# EAGLE schematic USB_Amp (EAGLE 9.6.2)
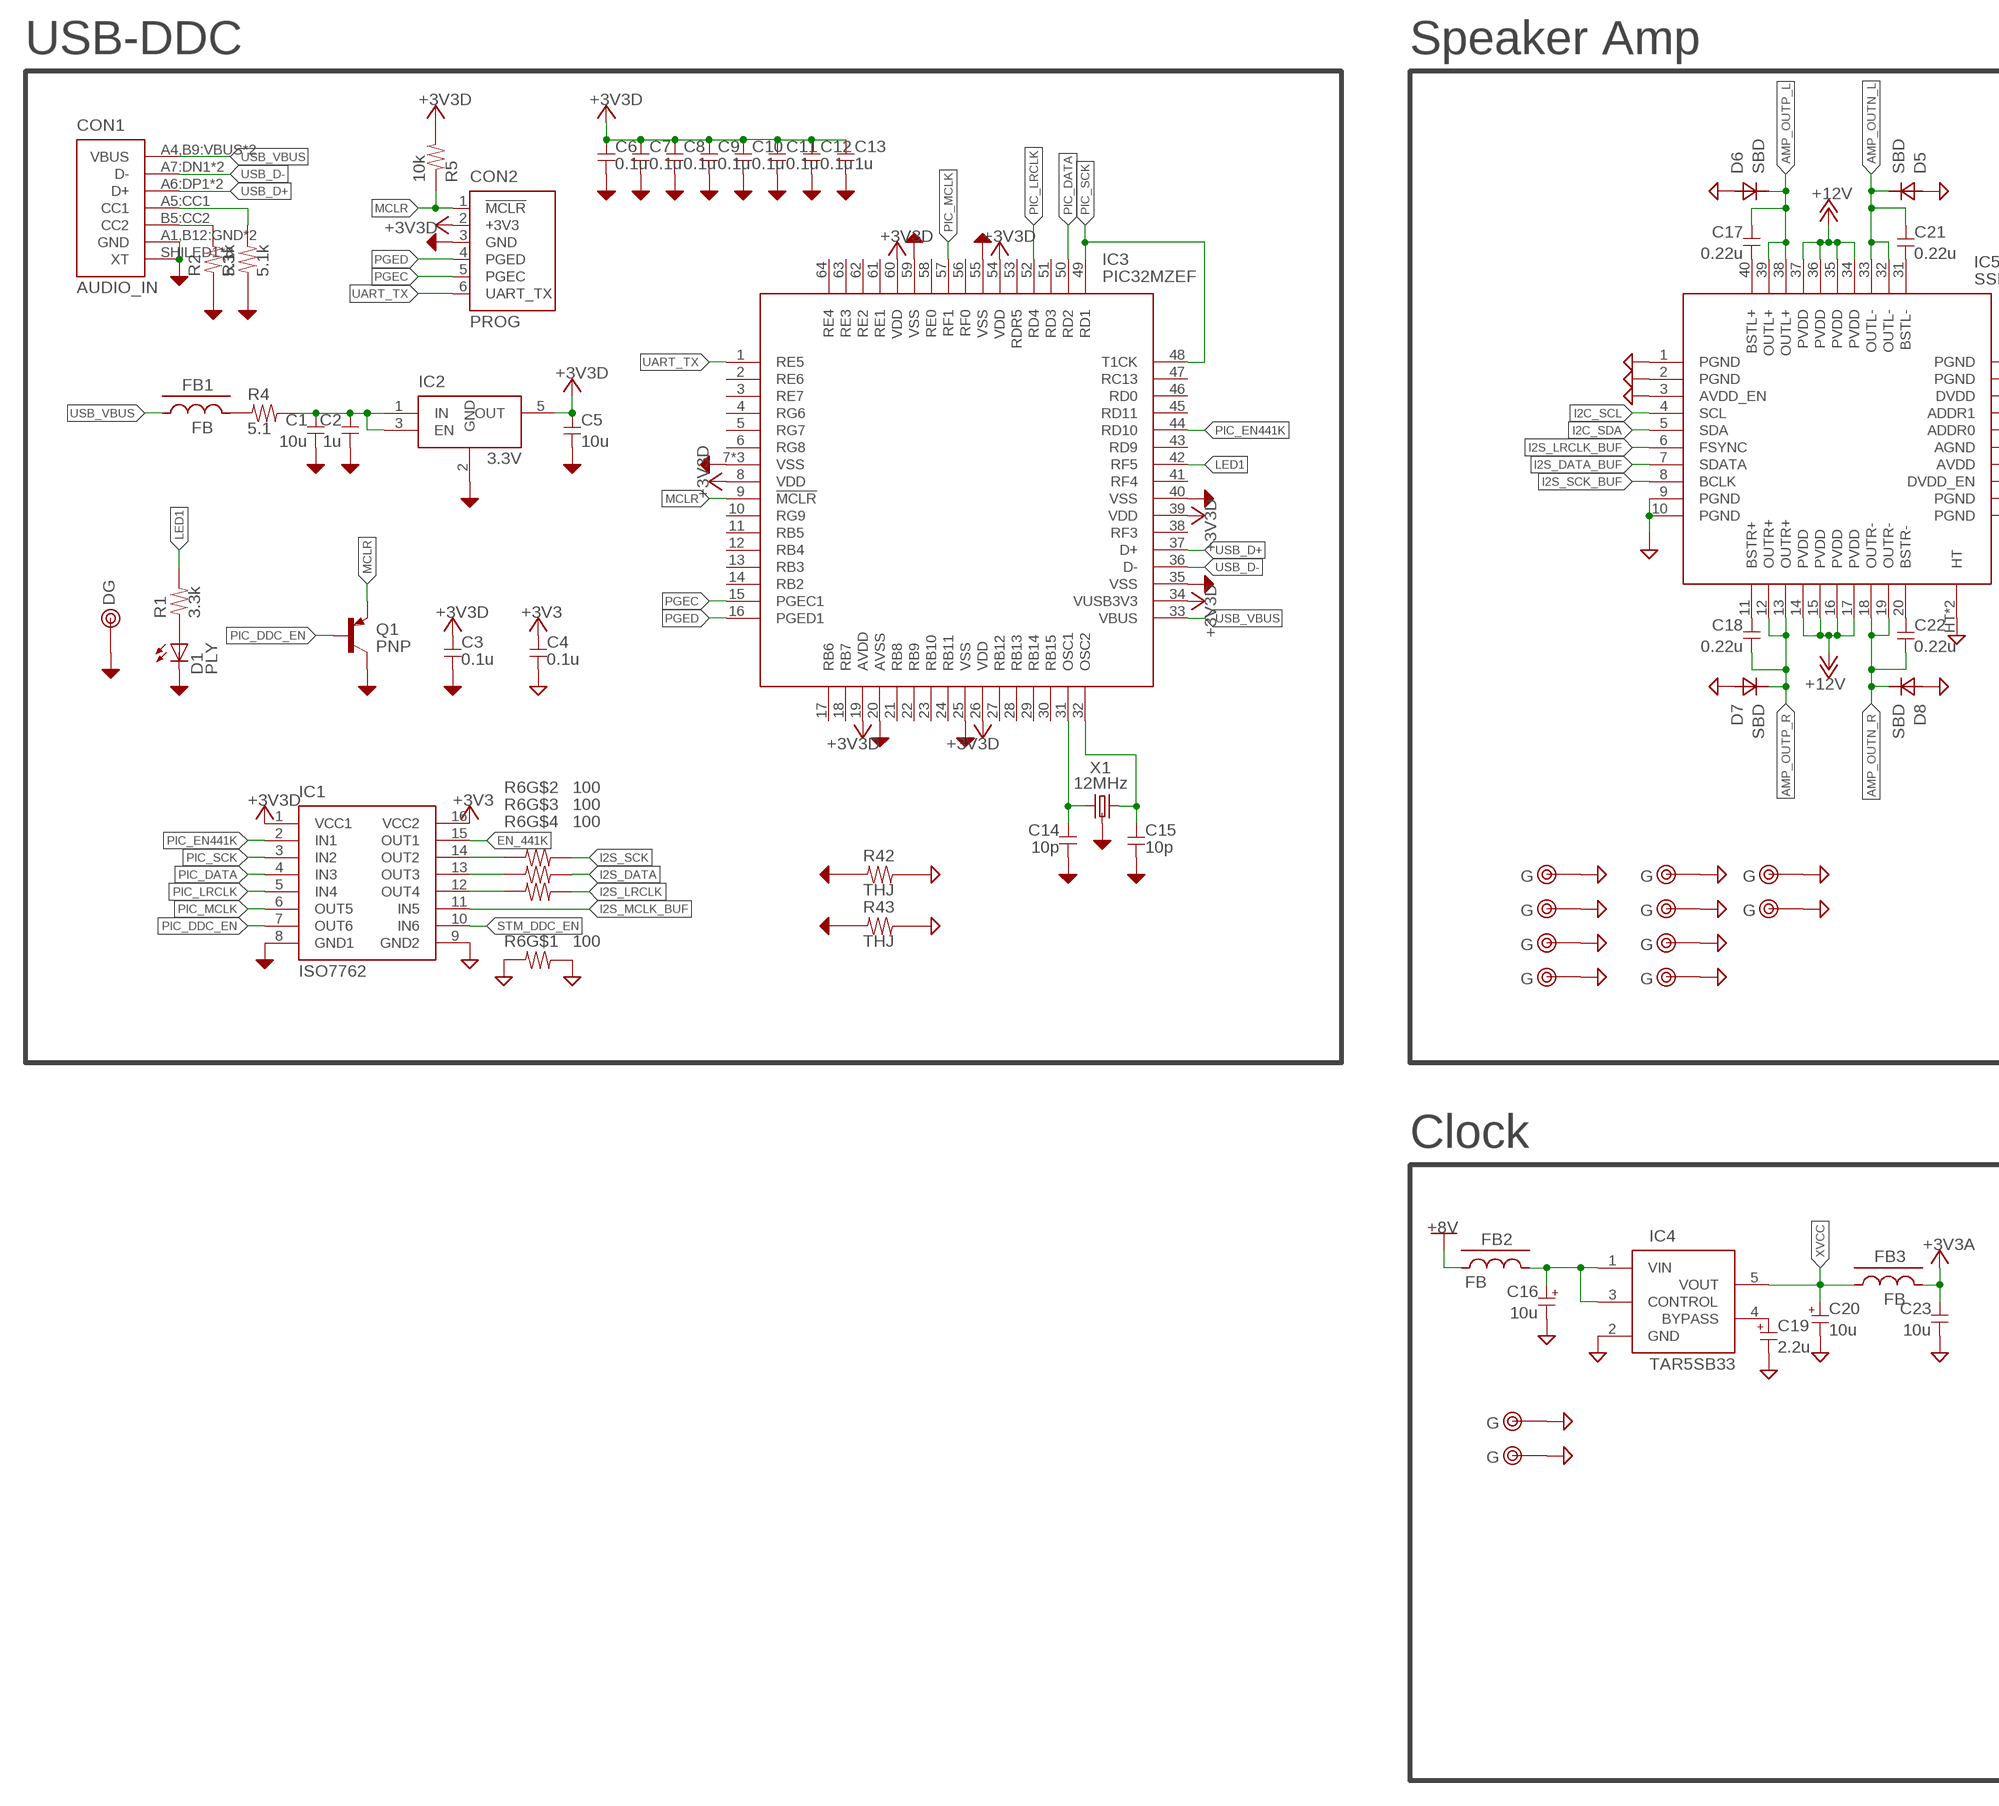
[diagram p0: schematic, sheet 1, part 1 of 2]
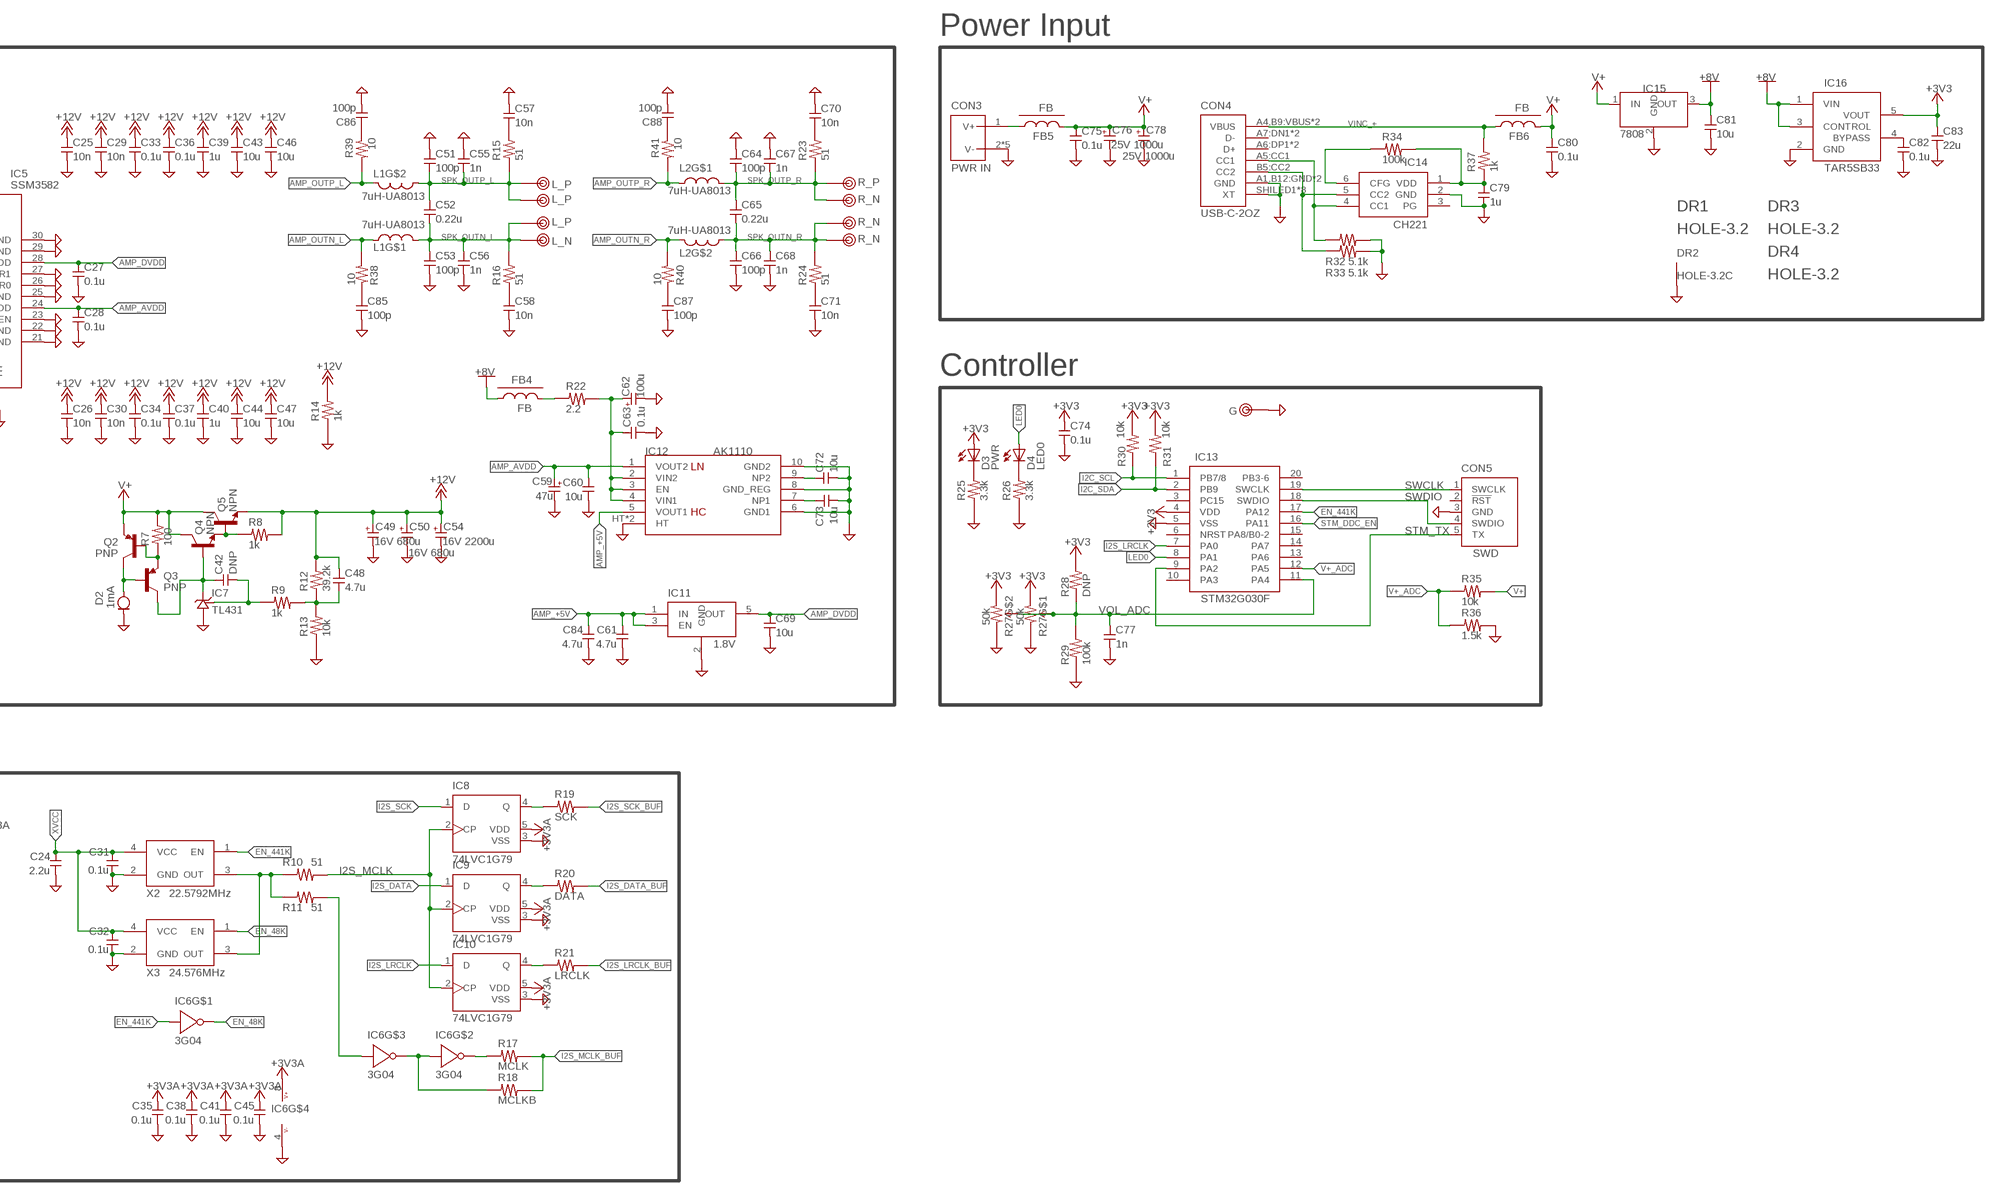
[diagram p1: schematic, sheet 1, part 2 of 2]

## Parts
C1  10u  C-2012  [2012]
C2  1u  C-1608  [1608C]
C3  0.1u  C-1608  [1608C]
C4  0.1u  C-1005  [1005]
C5  10u  C-2012  [2012]
C6  0.1u  C-1608  [1608C]
C7  0.1u  C-1608  [1608C]
C8  0.1u  C-1608  [1608C]
C9  0.1u  C-1608  [1608C]
C10  0.1u  C-1608  [1608C]
C11  0.1u  C-1608  [1608C]
C12  0.1u  C-1608  [1608C]
C13  1u  C-1608  [1608C]
C14  10p  C-1005  [1005]
C15  10p  C-1005  [1005]
C16  10u  CPOL2012  [2012-POL]
C17  0.22u  C-1608  [1608C]
C18  0.22u  C-1608  [1608C]
C19  2.2u  CPOL2012  [2012-POL]
C20  10u  CPOL2012  [2012-POL]
C21  0.22u  C-1608  [1608C]
C22  0.22u  C-1608  [1608C]
C23  10u  C-2012  [2012]
C24  2.2u  C-2012  [2012]
C25  10n  C-1005  [1005]
C26  10n  C-1005  [1005]
C27  0.1u  C-1608  [1608C]
C28  0.1u  C-1608  [1608C]
C29  10n  C-1005  [1005]
C30  10n  C-1005  [1005]
C31  0.1u  C-1608  [1608C]
C32  0.1u  C-1608  [1608C]
C33  0.1u  C-1005  [1005]
C34  0.1u  C-1005  [1005]
C35  0.1u  C-1005  [1005]
C36  0.1u  C-1005  [1005]
C37  0.1u  C-1005  [1005]
C38  0.1u  C-1005  [1005]
C39  1u  C-2012  [2012]
C40  1u  C-2012  [2012]
C41  0.1u  C-1005  [1005]
C42  DNP  C-1608  [1608C]
C43  10u  C-3225  [3225]
C44  10u  C-3225  [3225]
C45  0.1u  C-1005  [1005]
C46  10u  C-3225  [3225]
C47  10u  C-3225  [3225]
C48  4.7u  C-3216  [3216]
C49  16V 680u  CPOLE5-10  [E5-10]
C50  16V 680u  CPOLE5-10  [E5-10]
C51  100p  C-1608  [1608C]
C52  0.22u  C-5W  [C050W]
C53  100p  C-1608  [1608C]
C54  16V 2200u  CPOLE5-13  [E5-13]
C55  1n  C-2012  [2012]
C56  1n  C-2012  [2012]
C57  10n  C-5W2  [C050W2]
C58  10n  C-5W2  [C050W2]
C59  47u  CPOLE2.5-5  [E2.5-5]
C60  10u  C-2012  [2012]
C61  4.7u  C-2012  [2012]
C62  100u  CPOLE2.5-6.5  [E2.5-6.5]
C63  0.1u  C-1608  [1608C]
C64  100p  C-1608  [1608C]
C65  0.22u  C-5W  [C050W]
C66  100p  C-1608  [1608C]
C67  1n  C-2012  [2012]
C68  1n  C-2012  [2012]
C69  10u  C-2012  [2012]
C70  10n  C-5W2  [C050W2]
C71  10n  C-5W2  [C050W2]
C72  10u  C-2012  [2012]
C73  10u  C-2012  [2012]
C74  0.1u  C-1608  [1608C]
C75  0.1u  C-1608  [1608C]
C76  25V 1000u  CPOLE5-10  [E5-10]
C77  1n  C-1608  [1608C]
C78  25V 1000u  CPOLE5-10  [E5-10]
C79  1u  C-1608  [1608C]
C80  0.1u  C-1608  [1608C]
C81  10u  C-3216  [3216]
C82  0.1u  C-1608  [1608C]
C83  22u  C-2012  [2012]
C84  4.7u  C-2012  [2012]
C85  100p  C-1608  [1608C]
C86  100p  C-1608  [1608C]
C87  100p  C-1608  [1608C]
C88  100p  C-1608  [1608C]
CON1  AUDIO_IN  USB-C-2OZ  [5077CR-16-SMC2-BK-TR-2OZ]
CON2  PROG  PIC32_CON  [1X06]
CON3  PWR IN  POWER_CON  [2.1MM_CON]
CON4  USB-C-2OZ  [5077CR-16-SMC2-BK-TR-2OZ]
CON5  SWD  SWD_CON  [SWD_CON]
D1  PLY  LED-SMD1608  [D1608]
D2  1mA  CRD-SMD  [SOD123]
D3  PWR  LED-2.5  [LED2.5]
D4  LED0  LED-2.5  [LED2.5]
D5  SBD  DIODE-323  [SOD323]
D6  SBD  DIODE-323  [SOD323]
D7  SBD  DIODE-323  [SOD323]
D8  SBD  DIODE-323  [SOD323]
DR1  HOLE-3.2  [HOLE_3.2]
DR2  HOLE-3.2C  [HOLE_3.2_CON2]
DR3  HOLE-3.2  [HOLE_3.2]
DR4  HOLE-3.2  [HOLE_3.2]
FB1  FB  FB-1608FB  [1608-FB]
FB2  FB  FB-1608FB  [1608-FB]
FB3  FB  FB-1608FB  [1608-FB]
FB4  FB  FB-2012-FB  [2012-R]
FB5  FB  FB-3216  [3216-FB]
FB6  FB  FB-3216  [3216-FB]
IC1  ISO7762  ISO6762-SSOP  [TSSOP16]
IC2  3.3V  TLV740  [SOT23-5]
IC3  PIC32MZEF  [QFN64HT]
IC4  TAR5SB33  [SOT23-5]
IC5  SSM3582  [QFN40HT]
IC6  3G04  TC7WU04FU  [SSOP8-P-0.65]
IC7  TL431  TL431-SC59  [SC59]
IC8  74LVC1G79  [TSSOP5]
IC9  74LVC1G79  [TSSOP5]
IC10  74LVC1G79  [TSSOP5]
IC11  1.8V  TLV740  [SOT23-5]
IC12  AK1110  [PLP10]
IC13  STM32G030F  [TSSOP20]
IC14  CH221  [SOT23-6]
IC15  7808  78X-SOP  [DPAK]
IC16  TAR5SB33  [SOT23-5]
L1  7uH-UA8013  L-DUAL  [UA8014]
L2  7uH-UA8013  L-DUAL  [UA8014]
Q1  PNP  PNP2SA1313  [SC59]
Q2  PNP  PNP2SA1313  [SC59]
Q3  PNP  PNP2SA1313  [SC59]
Q4  NPN  NPN2SC3325  [SC59]
Q5  NPN  NPN-SOT223  [SOT223]
R1  3.3k  R-1608  [1608]
R2  5.1k  R-1608  [1608]
R3  5.1k  R-1608  [1608]
R4  5.1  R-1608  [1608]
R5  10k  R-1608  [1608]
R6  100  R-ARRAY  [EXB28V]
R7  100  R-1608  [1608]
R8  1k  R-1608  [1608]
R9  1k  R-1608  [1608]
R10  51  R-1005  [1005]
R11  51  R-1005  [1005]
R12  39.2k  R-1608  [1608]
R13  10k  R-1608  [1608]
R14  1k  R-3216  [3216]
R15  51  R-2012  [2012]
R16  51  R-2012  [2012]
R17  MCLK  R-1005  [1005]
R18  MCLKB  R-1005  [1005]
R19  SCK  R-1005  [1005]
R20  DATA  R-1005  [1005]
R21  LRCLK  R-1005  [1005]
R22  2.2  R-2012H  [2012-R]
R23  51  R-2012  [2012]
R24  51  R-2012  [2012]
R25  3.3k  R-1608  [1608]
R26  3.3k  R-1608  [1608]
R27  50k  R-VAL2  [RK0972]
R28  DNP  R-1608  [1608]
R29  100k  R-1608  [1608]
R30  10k  R-1608  [1608]
R31  10k  R-1608  [1608]
R32  5.1k  R-1608  [1608]
R33  5.1k  R-1608  [1608]
R34  100k  R-1608  [1608]
R35  10k  R-1608  [1608]
R36  1.5k  R-1608  [1608]
R37  1k  R-2012  [2012]
R38  10  R-1608  [1608]
R39  10  R-1608  [1608]
R40  10  R-1608  [1608]
R41  10  R-1608  [1608]
R42  THJ  R-3216-2  [3216-2]
R43  THJ  R-3216-2  [3216-2]
TP1  L_P  TESTPIN-BIG  [TESTPIN-BIG]
TP2  L_N  TESTPIN-BIG  [TESTPIN-BIG]
TP3  R_P  TESTPIN-BIG  [TESTPIN-BIG]
TP4  R_N  TESTPIN-BIG  [TESTPIN-BIG]
TP5  DG  TESTPIN  [TESTPIN]
TP6  G  TESTPIN  [TESTPIN]
TP7  G  TESTPIN  [TESTPIN]
TP8  G  TESTPIN  [TESTPIN]
TP9  G  TESTPIN  [TESTPIN]
TP10  G  TESTPIN  [TESTPIN]
TP11  G  TESTPIN  [TESTPIN]
TP12  G  TESTPIN  [TESTPIN]
TP13  G  TESTPIN  [TESTPIN]
TP14  G  TESTPIN  [TESTPIN]
TP15  G  TESTPIN  [TESTPIN]
TP16  G  TESTPIN  [TESTPIN]
TP17  G  TESTPIN  [TESTPIN]
TP18  G  TESTPIN  [TESTPIN]
TP19  L_P  TESTPIN-MID  [TESTPIN-MID]
TP20  L_P  TESTPIN-MID  [TESTPIN-MID]
TP21  R_N  TESTPIN-MID  [TESTPIN-MID]
TP22  R_N  TESTPIN-MID  [TESTPIN-MID]
X1  12MHz  CRYSTAL2  [KC3225-CRYSTAL]
X2  22.5792MHz  OSC-KC3225  [KC3225]
X3  24.576MHz  OSC-KC3225  [KC3225]

## Nets
+3V3: C4.1 C74.1 C83.1 D3.A IC1.16(VCC2) IC13.4(VDD) IC16.5(VOUT) R27.3 R27.6 R28.2 R30.2 R31.2
+3V3A: C23.1 C35.1 C38.1 C41.1 C45.1 FB3.2 IC6.8(V+) IC8.5(VDD) IC9.5(VDD) IC10.5(VDD)
+3V3D: C3.1 C5.1 C6.1 C7.1 C8.1 C9.1 C10.1 C11.1 C12.1 C13.1 CON2.2(+3V3) IC1.1(VCC1) IC2.5(OUT) IC3.8(VDD) IC3.19(AVDD) IC3.26(VDD) IC3.34(VUSB3V3) IC3.39(VDD) IC3.54(VDD) IC3.60(VDD) R5.2
+8V: C81.1 FB2.1 FB4.1 IC15.3(OUT) IC16.1(VIN) IC16.3(CONTROL)
+12V: C25.1 C26.1 C29.1 C30.1 C33.1 C34.1 C36.1 C37.1 C39.1 C40.1 C43.1 C44.1 C46.1 C47.1 C48.1 C49.+ C50.+ C54.+ IC5.14(PVDD) IC5.15(PVDD) IC5.16(PVDD) IC5.17(PVDD) IC5.34(PVDD) IC5.35(PVDD) IC5.36(PVDD) IC5.37(PVDD) Q5.3(E) R8.2 R12.2 R14.2
AMP_+5V: C61.1 C84.1 IC11.1(IN) IC11.3(EN) IC12.5(VOUT1)
AMP_AVDD: C28.1 C59.+ C60.1 IC5.24(AVDD) IC12.1(VOUT2)
AMP_DVDD: C27.1 C69.1 IC5.28(DVDD) IC11.5(OUT)
AMP_OUTN_L: C21.1 D5.2(K) IC5.32(OUTL-) IC5.33(OUTL-) L1.1 R38.2
AMP_OUTN_R: C22.2 D8.2(K) IC5.18(OUTR-) IC5.19(OUTR-) L2.4 R40.2
AMP_OUTP_L: C17.1 D6.2(K) IC5.38(OUTL+) IC5.39(OUTL+) L1.4 R39.2
AMP_OUTP_R: C18.2 D7.2(K) IC5.12(OUTR+) IC5.13(OUTR+) L2.1 R41.2
DGND: C1.2 C2.2 C3.2 C5.2 C6.2 C7.2 C8.2 C9.2 C10.2 C11.2 C12.2 C13.2 C14.2 C15.2 CON1.A1,B12:GND(GND) CON1.B1,A12:GND(GND) CON1.SHILED1(XT) CON1.SHILED2(XT) CON1.SHILED3(XT) CON1.SHILED4(XT) CON1.SHILED5(XT) CON1.SHILED6(XT) CON1.SHILED7(XT) CON1.SHILED8(XT) CON2.3(GND) D1.K IC1.8(GND1) IC2.2(GND) IC3.7(VSS) IC3.20(AVSS) IC3.25(VSS) IC3.35(VSS) IC3.40(VSS) IC3.55(VSS) IC3.59(VSS) IC3.HT2(VSS) IC3.HT(VSS) Q1.3(C) R2.1 R3.1 R42.1 R43.1 TP5.1 X1.2(GND) X1.4(GND)
EN_48K: IC6.7(OUT) X3.1(EN)
EN_441K: IC1.15(OUT1) IC6.1(IN) IC13.17(PA12) X2.1(EN)
GND: C4.2 C16.2 C19.2 C20.2 C23.2 C24.2 C25.2 C26.2 C27.2 C28.2 C29.2 C30.2 C31.2 C32.2 C33.2 C34.2 C35.2 C36.2 C37.2 C38.2 C39.2 C40.2 C41.2 C43.2 C44.2 C45.2 C46.2 C47.2 C49.- C50.- C51.1 C53.2 C54.- C55.1 C56.2 C57.1 C57.3 C58.2 C58.4 C59.- C60.2 C61.2 C62.- C63.2 C64.1 C66.2 C67.1 C68.2 C69.2 C70.1 C70.3 C71.2 C71.4 C72.2 C73.2 C74.2 C75.2 C76.- C77.2 C78.- C79.2 C80.2 C81.2 C82.2 C83.2 C84.2 C85.2 C86.2 C87.2 C88.2 CON3.2(V-) CON3.3(V-) CON3.4(V-) CON3.5(V-) CON3.6(V-) CON4.A1,B12:GND(GND) CON4.B1,A12:GND(GND) CON4.SHILED1(XT) CON4.SHILED2(XT) CON4.SHILED3(XT) CON4.SHILED4(XT) CON4.SHILED5(XT) CON4.SHILED6(XT) CON4.SHILED7(XT) CON4.SHILED8(XT) CON5.3(GND) D2.2(K) D5.1(A) D6.1(A) D7.1(A) D8.1(A) DR2.T(HT) IC1.9(GND2) IC4.2(GND) IC5.1(PGND) IC5.2(PGND) IC5.3(AVDD_EN) IC5.9(PGND) IC5.10(PGND) IC5.21(PGND) IC5.22(PGND) IC5.23(DVDD_EN) IC5.25(AGND) IC5.26(ADDR0) IC5.27(ADDR1) IC5.29(PGND) IC5.30(PGND) IC5.HT IC5.HT2(HT) IC6.4(V-) IC7.3(GND) IC8.3(VSS) IC9.3(VSS) IC10.3(VSS) IC11.2(GND) IC12.6(GND1) IC12.8(GND_REG) IC12.10(GND2) IC12.HT IC12.HT2(HT) IC13.5(VSS) IC14.2(GND) IC15.2(GND) IC16.2(GND) R6.1 R6.8 R13.1 R14.1 R25.1 R26.1 R27.1 R27.4 R29.1 R32.2 R33.2 R36.2 R42.2 R43.2 TP6.1 TP7.1 TP8.1 TP9.1 TP10.1 TP11.1 TP12.1 TP13.1 TP14.1 TP15.1 TP16.1 TP17.1 TP18.1 X2.2(GND) X3.2(GND)
I2C_SCL: IC5.4(SCL) IC13.1(PB7/8) R30.1
I2C_SDA: IC5.5(SDA) IC13.2(PB9) R31.1
I2S_DATA: IC9.1(D) R6.6
I2S_DATA_BUF: IC5.7(SDATA) R20.2
I2S_LRCLK: IC10.1(D) IC13.7(PA0) R6.5
I2S_LRCLK_BUF: IC5.6(FSYNC) R21.2
I2S_MCLK: IC8.2(CP) IC9.2(CP) IC10.2(CP) R10.2
I2S_MCLK2: IC6.3(IN) R11.2
I2S_MCLK_BUF: IC1.11(IN5) R17.2 R18.2
I2S_SCK: IC8.1(D) R6.7
I2S_SCK_BUF: IC5.8(BCLK) R19.2
LED0: D4.A IC13.8(PA1)
LED1: IC3.42(RF5) R1.2
MCLK_OSC: R10.1 R11.1 X2.3(OUT) X3.3(OUT)
MCLR: CON2.1(!MCLR) IC3.9(!MCLR) Q1.2(E) R5.1
N$1: CON1.B5:CC2(CC2) R2.2
N$2: CON1.A5:CC1(CC1) R3.2
N$3: FB1.2 R4.1
N$4: C1.1 C2.1 IC2.1(IN) IC2.3(EN) R4.2
N$5: C14.1 IC3.31(OSC1) X1.3
N$6: C57.2 C57.4 R15.2
N$7: C15.1 IC3.32(OSC2) X1.1
N$8: IC1.14(OUT2) R6.2
N$9: D1.A R1.1
N$10: IC8.4(Q) R19.1
N$11: IC9.4(Q) R20.1
N$12: C21.2 IC5.31(BSTL-)
N$13: C17.2 IC5.40(BSTL+)
N$14: IC10.4(Q) R21.1
N$15: C58.1 C58.3 R16.1
N$16: Q4.2(E) Q5.1(B) R8.1
N$17: C18.1 IC5.11(BSTR+)
N$18: C22.1 IC5.20(BSTR-)
N$19: C71.1 C71.3 R24.1
N$20: C42.2 IC7.1(REF) R9.1
N$21: C70.2 C70.4 R23.2
N$22: IC1.13(OUT3) R6.3
N$23: C19.1 IC4.4(BYPASS)
N$24: IC1.12(OUT4) R6.4
N$25: C42.1 IC7.2(OUT) Q3.3(C) Q4.1(B)
N$26: C73.1 IC12.7(NP1)
N$27: C72.1 IC12.9(NP2)
N$28: Q2.1(B) Q3.2(E) R7.1
N$29: C62.+ C63.1 IC12.2(VIN2) IC12.3(EN) IC12.4(VIN1) R22.2
N$30: C48.2 R9.2 R12.1 R13.2
N$31: CON4.A5:CC1(CC1) IC14.4(CC1) R32.1
N$32: CON4.B5:CC2(CC2) IC14.5(CC2) R33.1
N$33: C79.1 IC14.1(VDD) R34.2 R37.1
N$34: IC14.6(CFG) R34.1
N$35: C82.1 IC16.4(BYPASS)
N$36: D3.K R25.2
N$37: IC6.5(OUT) IC6.6(IN) R18.1
N$38: D2.1(A) Q2.3(C) Q3.1(B)
N$39: IC6.2(OUT) R17.1
N$40: C86.1 R39.1
N$41: D4.K R26.2
N$42: FB4.2 R22.1
N$43: C16.1 FB2.2 IC4.1(VIN) IC4.3(CONTROL)
N$44: C87.1 R40.1
N$45: C85.1 R38.1
N$46: C88.1 R41.1
PGEC: CON2.5(PGEC) IC3.15(PGEC1)
PGED: CON2.4(PGED) IC3.16(PGED1)
PIC_DATA: IC1.4(IN3) IC3.50(RD2)
PIC_DDC_EN: IC1.7(OUT6) Q1.1(B)
PIC_EN441K: IC1.2(IN1) IC3.44(RD10)
PIC_LRCLK: IC1.5(IN4) IC3.52(RD4)
PIC_MCLK: IC1.6(OUT5) IC3.57(RF1)
PIC_SCK: IC1.3(IN2) IC3.48(T1CK) IC3.49(RD1)
SPK_OUTN_L: C52.2 C52.4 C53.1 C56.1 L1.2 R16.2 TP2.1 TP19.1
SPK_OUTN_R: C65.2 C65.4 C66.1 C68.1 L2.3 R24.2 TP4.1 TP22.1
SPK_OUTP_L: C51.2 C52.1 C52.3 C55.2 L1.3 R15.1 TP1.1 TP20.1
SPK_OUTP_R: C64.2 C65.1 C65.3 C67.2 L2.2 R23.1 TP3.1 TP21.1
STM_DDC_EN: IC1.10(IN6) IC13.16(PA11)
STM_TX: CON5.5(TX) IC13.9(PA2)
SWCLK: CON5.1(SWCLK) IC13.19(SWCLK)
SWDIO: CON5.4(SWDIO) IC13.18(SWDIO)
UART_TX: CON2.6(UART_TX) IC3.1(RE5)
USB_D+ [USB]: CON1.A6:DP1(D+) CON1.B6:DP2(D+) IC3.37(D+)
USB_D- [USB]: CON1.A7:DN1(D-) CON1.B7:DN2(D-) IC3.36(D-)
USB_VBUS: CON1.A4,B9:VBUS(VBUS) CON1.B4,A9:VBUS(VBUS) FB1.1 IC3.33(VBUS)
V+: C75.1 C76.+ C78.+ C80.1 FB5.2 FB6.2 IC15.1(IN) Q2.2(E) Q4.3(C) Q5.2(C) Q5.4(C) R7.2 R35.2
V+_ADC: IC13.12(PA5) R35.1 R36.1
VIN+: CON3.1(V+) FB5.1
VINC_+: CON4.A4,B9:VBUS(VBUS) CON4.B4,A9:VBUS(VBUS) FB6.1 R37.2
VOL_ADC: C77.1 IC13.11(PA4) R27.2 R27.5 R28.1 R29.2
XVCC: C20.1 C24.1 C31.1 C32.1 FB3.1 IC4.5(VOUT) X2.4(VCC) X3.4(VCC)
Unconnected: CON4.A6:DP1(D+) CON4.A7:DN1(D-) CON4.B6:DP2(D+) CON4.B7:DN2(D-) CON5.2(!RST) IC3.2(RE6) IC3.3(RE7) IC3.4(RG6) IC3.5(RG7) IC3.6(RG8) IC3.10(RG9) IC3.11(RB5) IC3.12(RB4) IC3.13(RB3) IC3.14(RB2) IC3.17(RB6) IC3.18(RB7) IC3.21(RB8) IC3.22(RB9) IC3.23(RB10) IC3.24(RB11) IC3.27(RB12) IC3.28(RB13) IC3.29(RB14) IC3.30(RB15) IC3.38(RF3) IC3.41(RF4) IC3.43(RD9) IC3.45(RD11) IC3.46(RD0) IC3.47(RC13) IC3.51(RD3) IC3.53(RDR5) IC3.56(RF0) IC3.58(RE0) IC3.61(RE1) IC3.62(RE2) IC3.63(RE3) IC3.64(RE4) IC13.3(PC15) IC13.6(NRST) IC13.10(PA3) IC13.13(PA6) IC13.14(PA7) IC13.15(PA8/B0-2) IC13.20(PB3-6) IC14.3(PG)

## Notes on the sheet
- USB-DDC | Speaker Amp | Power Input
- Controller
- Clock

## Library data of the parts
C1-C15 C17 C18 C21-C48 C51-C53 C55-C58 C60 C61 C63-C75 C77 C79-C88 = my_rcl:C
C16 C19 C20 C49 C50 C54 C59 C62 C76 C78 = my_rcl:CPOL
CON1 CON4 = my_connector:USB-C
CON2 = my_connector:PIC32_CON
CON3 = my_connector:POWER_CON
CON5 = my_connector:SWD_CON
D1 D3 D4 = my_rcl:LED
D2 = my_rcl:CRD
D5-D8 = my_rcl:DIODE
DR1 DR3 DR4 = my_connector:HOLE-3.2
DR2 = my_connector:HOLE-3.2C
FB1-FB6 = my_rcl:FB
IC1 = my_ic:ISO6762
IC2 IC11 = my_ic:TLV740
IC3 = my_ic:PIC32MZEF
IC4 IC16 = my_ic:TAR5SB33
IC5 = my_ic:SSM3582
IC6 = my_ic:TC7WU04FU
IC7 = my_ic:TL431
IC8-IC10 = my_ic:74LVC1G79
IC12 = my_ic:AK1110
IC13 = my_ic:STM32G030F
IC14 = my_ic:CH221
IC15 = my_ic:78X
L1 L2 = my_rcl:L-DUAL
Q1-Q3 = my_ic:PNP
Q4 Q5 = my_ic:NPN
R1-R5 R7-R26 R28-R43 = my_rcl:R
R6 = my_rcl:R-ARRAY
R27 = my_rcl:R-VAL2
TP1-TP22 = my_connector:TESTPIN
X1 = my_rcl:CRYSTAL2: CRYSTAL
X2 X3 = my_rcl:OSC

## Net classes
1 USB: width 0.27 mm